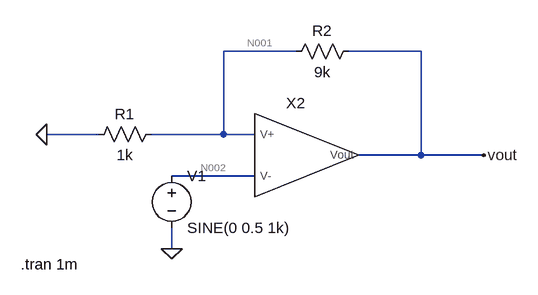
[diagram p0: schematic Non_Inverting_Amplifer.asc]
Non_Inverting_Amplifer.asc, the LTspice schematic file:
Version 4
SHEET 1 880 680
WIRE 144 16 32 16
WIRE 336 16 224 16
WIRE -160 144 -240 144
WIRE 32 144 32 16
WIRE 32 144 -80 144
WIRE 80 144 32 144
WIRE 336 176 336 16
WIRE 336 176 240 176
WIRE 432 176 336 176
WIRE 80 208 -48 208
WIRE -48 320 -48 288
FLAG -240 144 0
FLAG -48 320 0
FLAG 432 176 vout
SYMBOL res -64 128 R90
WINDOW 0 0 56 VBottom 2
WINDOW 3 32 56 VTop 2
SYMATTR InstName R1
SYMATTR Value 1k
SYMBOL res 240 0 R90
WINDOW 0 0 56 VBottom 2
WINDOW 3 32 56 VTop 2
SYMATTR InstName R2
SYMATTR Value 9k
SYMBOL MY_IDEAL_opamp 144 176 R0
SYMATTR InstName X2
SYMBOL voltage -48 192 R0
WINDOW 123 0 0 Left 0
WINDOW 39 0 0 Left 0
SYMATTR InstName V1
SYMATTR Value SINE(0 0.5 1k)
TEXT -280 344 Left 2 !.tran 1m

The netlist it stands for:
* Non_Inverting_Amplifer.asc
R1 N001 0 1k
R2 vout N001 9k
XX2 N001 N002 vout MY_IDEAL_opamp  ; pins V+ V- Vout
V1 N002 0 SINE(0 0.5 1k)
.tran 1m
.backanno
.end

* Results of the author's LTspice run, read from the files saved beside the schematic
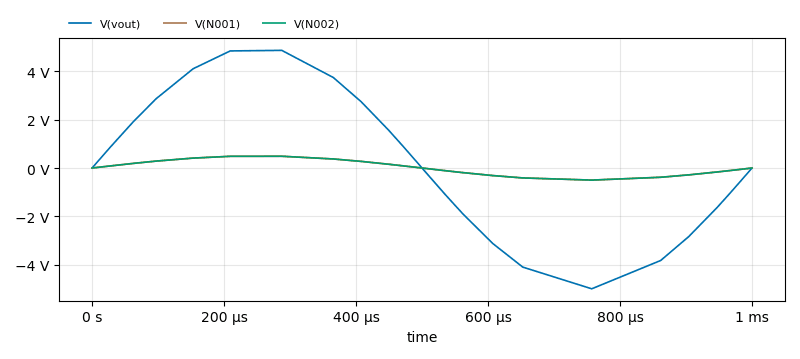
[diagram p1: Transient Analysis of Non_Inverting_Amplifer.asc, plotted from the saved traces]
* Transient Analysis, 1 run:
*   V(vout): min -4.989 V, max 4.861 V, average 17.71 mV, rms 3.481 V, last 0 V
*   V(N001): min -498.9 mV, max 486.1 mV, average 1.771 mV, rms 348.1 mV, last 0 V
*   V(N002): min -499 mV, max 486.1 mV, average 1.771 mV, rms 348.1 mV, last 0 V